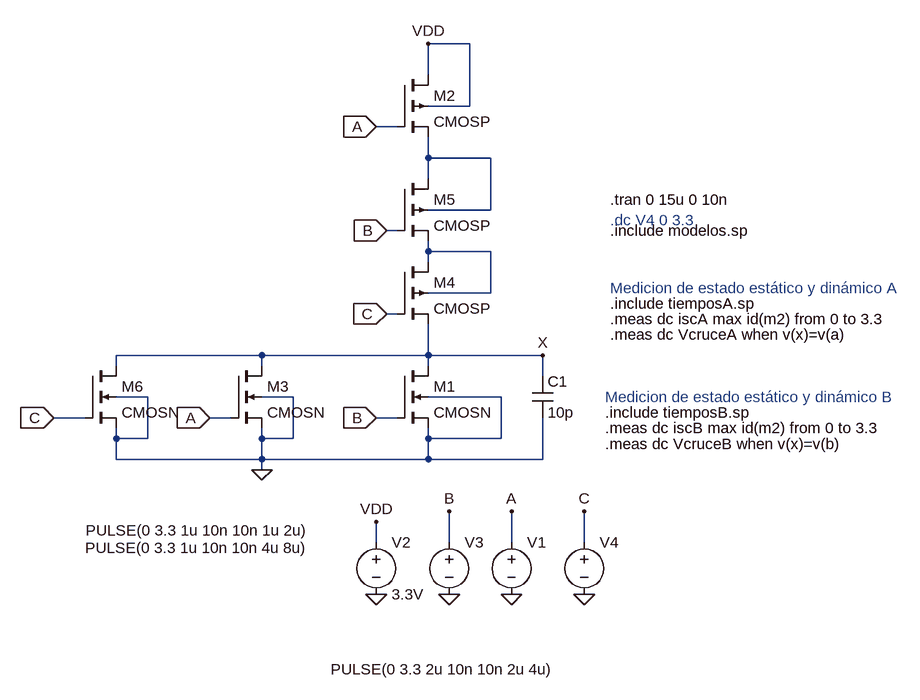
[diagram p0: schematic 3inputs_NOR_1mA.asc]
3inputs_NOR_1mA.asc, the LTspice schematic file:
Version 4
SHEET 1 1484 824
WIRE 224 -400 160 -400
WIRE 160 -352 160 -400
WIRE 224 -304 224 -400
WIRE 224 -304 160 -304
WIRE 112 -272 80 -272
WIRE 160 -224 160 -256
WIRE 256 -224 160 -224
WIRE 160 -192 160 -224
WIRE 256 -144 256 -224
WIRE 256 -144 160 -144
WIRE 112 -112 96 -112
WIRE 160 -80 160 -96
WIRE 256 -80 160 -80
WIRE 160 -64 160 -80
WIRE 256 -16 256 -80
WIRE 256 -16 160 -16
WIRE 112 16 96 16
WIRE -96 80 -320 80
WIRE 160 80 160 32
WIRE 160 80 -96 80
WIRE 336 80 160 80
WIRE -320 96 -320 80
WIRE -96 96 -96 80
WIRE 160 96 160 80
WIRE 336 112 336 80
WIRE -272 144 -320 144
WIRE -48 144 -96 144
WIRE 272 144 160 144
WIRE -368 176 -416 176
WIRE -144 176 -176 176
WIRE 112 176 80 176
WIRE -320 208 -320 192
WIRE -272 208 -272 144
WIRE -272 208 -320 208
WIRE -96 208 -96 192
WIRE -48 208 -48 144
WIRE -48 208 -96 208
WIRE 160 208 160 192
WIRE 272 208 272 144
WIRE 272 208 160 208
WIRE -320 240 -320 208
WIRE -96 240 -96 208
WIRE -96 240 -320 240
WIRE 160 240 160 208
WIRE 160 240 -96 240
WIRE 336 240 336 176
WIRE 336 240 160 240
WIRE -96 256 -96 240
WIRE 80 368 80 336
WIRE 192 368 192 320
WIRE 288 368 288 320
WIRE 400 368 400 320
FLAG 80 336 VDD
FLAG 160 -400 VDD
FLAG 288 320 A
FLAG 80 -272 A
IOPIN 80 -272 In
FLAG 192 320 B
FLAG 96 16 C
IOPIN 96 16 In
FLAG -176 176 A
IOPIN -176 176 In
FLAG 80 176 B
IOPIN 80 176 In
FLAG -96 256 0
FLAG 336 80 X
FLAG 80 448 0
FLAG 192 448 0
FLAG 288 448 0
FLAG -416 176 C
IOPIN -416 176 In
FLAG 400 320 C
FLAG 400 448 0
FLAG 96 -112 B
IOPIN 96 -112 In
SYMBOL nmos4 112 96 R0
SYMATTR InstName M1
SYMATTR Value CMOSN
SYMATTR Value2 l=0.6u w=4.2u
SYMBOL pmos4 112 -352 R0
SYMATTR InstName M2
SYMATTR Value CMOSP
SYMATTR Value2 l=.6u w=18.9u
SYMBOL voltage 288 352 R0
WINDOW 3 -655 -3 Left 2
WINDOW 123 0 0 Left 0
WINDOW 39 0 0 Left 0
SYMATTR Value PULSE(0 3.3 1u 10n 10n 1u 2u)
SYMATTR InstName V1
SYMBOL voltage 80 352 R0
WINDOW 123 0 0 Left 0
WINDOW 39 0 0 Left 0
SYMATTR InstName V2
SYMATTR Value 3.3V
SYMBOL cap 320 112 R0
SYMATTR InstName C1
SYMATTR Value 10p
SYMBOL nmos4 -144 96 R0
SYMATTR InstName M3
SYMATTR Value CMOSN
SYMATTR Value2 l=0.6u w=4.2u
SYMBOL pmos4 112 -64 R0
SYMATTR InstName M4
SYMATTR Value CMOSP
SYMATTR Value2 l=.6u w=18.9u
SYMBOL voltage 192 352 R0
WINDOW 3 -182 211 Left 2
WINDOW 123 0 0 Left 0
WINDOW 39 0 0 Left 0
SYMATTR Value PULSE(0 3.3 2u 10n 10n 2u 4u)
SYMATTR InstName V3
SYMBOL pmos4 112 -192 R0
SYMATTR InstName M5
SYMATTR Value CMOSP
SYMATTR Value2 l=.6u w=18.9u
SYMBOL nmos4 -368 96 R0
SYMATTR InstName M6
SYMATTR Value CMOSN
SYMATTR Value2 l=0.6u w=4.2u
SYMBOL voltage 400 352 R0
WINDOW 3 -768 24 Left 2
WINDOW 123 0 0 Left 0
WINDOW 39 0 0 Left 0
SYMATTR Value PULSE(0 3.3 1u 10n 10n 4u 8u)
SYMATTR InstName V4
TEXT 440 -112 Left 2 !.include modelos.sp
TEXT 440 -160 Left 2 !.tran 0 15u 0 10n
TEXT 440 48 Left 2 !.meas dc VcruceA when v(x)=v(a)
TEXT 440 0 Left 2 !.include tiemposA.sp
TEXT 440 24 Left 2 !.meas dc iscA max id(m2) from 0 to 3.3
TEXT 440 -24 Left 2 ;Medicion de estado estático y dinámico A
TEXT 432 216 Left 2 !.meas dc VcruceB when v(x)=v(b)
TEXT 432 192 Left 2 !.meas dc iscB max id(m2) from 0 to 3.3
TEXT 432 144 Left 2 ;Medicion de estado estático y dinámico B
TEXT 432 168 Left 2 !.include tiemposB.sp
TEXT 440 -128 Left 2 ;.dc V4 0 3.3

The netlist it stands for:
* 3inputs_NOR_1mA.asc
M1 X B 0 0 CMOSN l=0.6u w=4.2u
M2 VDD A N001 VDD CMOSP l=.6u w=18.9u
V1 A 0 PULSE(0 3.3 1u 10n 10n 1u 2u)
V2 VDD 0 3.3V
C1 X 0 10p
M3 X A 0 0 CMOSN l=0.6u w=4.2u
M4 N002 C X N002 CMOSP l=.6u w=18.9u
V3 B 0 PULSE(0 3.3 2u 10n 10n 2u 4u)
M5 N001 B N002 N001 CMOSP l=.6u w=18.9u
M6 X C 0 0 CMOSN l=0.6u w=4.2u
V4 C 0 PULSE(0 3.3 1u 10n 10n 4u 8u)
.model NMOS NMOS
.model PMOS PMOS
.lib standard.mos
.include modelos.sp
.tran 0 15u 0 10n
.meas dc VcruceA when v(x)=v(a)
.include tiemposA.sp
.meas dc iscA max id(m2) from 0 to 3.3
* Medicion de estado estático y dinámico A
.meas dc VcruceB when v(x)=v(b)
.meas dc iscB max id(m2) from 0 to 3.3
* Medicion de estado estático y dinámico B
.include tiemposB.sp
* .dc V4 0 3.3
.backanno
.end

* Results of the author's LTspice run, read from the files saved beside the schematic
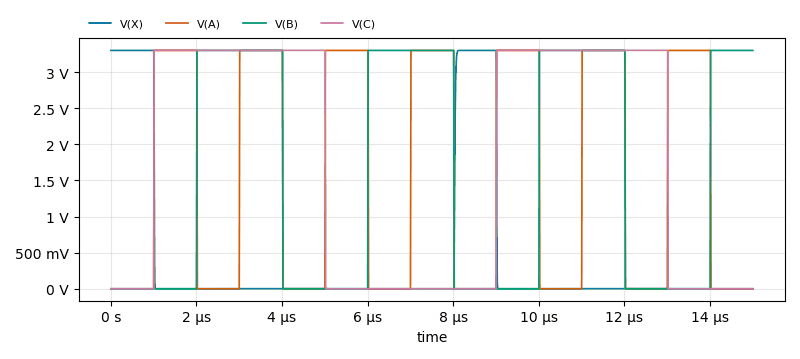
[diagram p1: Transient Analysis of 3inputs_NOR_1mA.asc, plotted from the saved traces]
* Transient Analysis, 1 run:
*   V(X): min -661.2 µV, max 3.301 V, average 438.3 mV, rms 1.198 V, last 465.7 nV
*   V(A): min 0 V, max 3.3 V, average 1.555 V, rms 2.262 V, last 0 V
*   V(B): min 0 V, max 3.3 V, average 1.545 V, rms 2.257 V, last 3.3 V
*   V(C): min 0 V, max 3.3 V, average 1.764 V, rms 2.412 V, last 0 V